# Altium schematic sheet NNLightSwitcher_DDR3.SchDoc
size A4 portrait
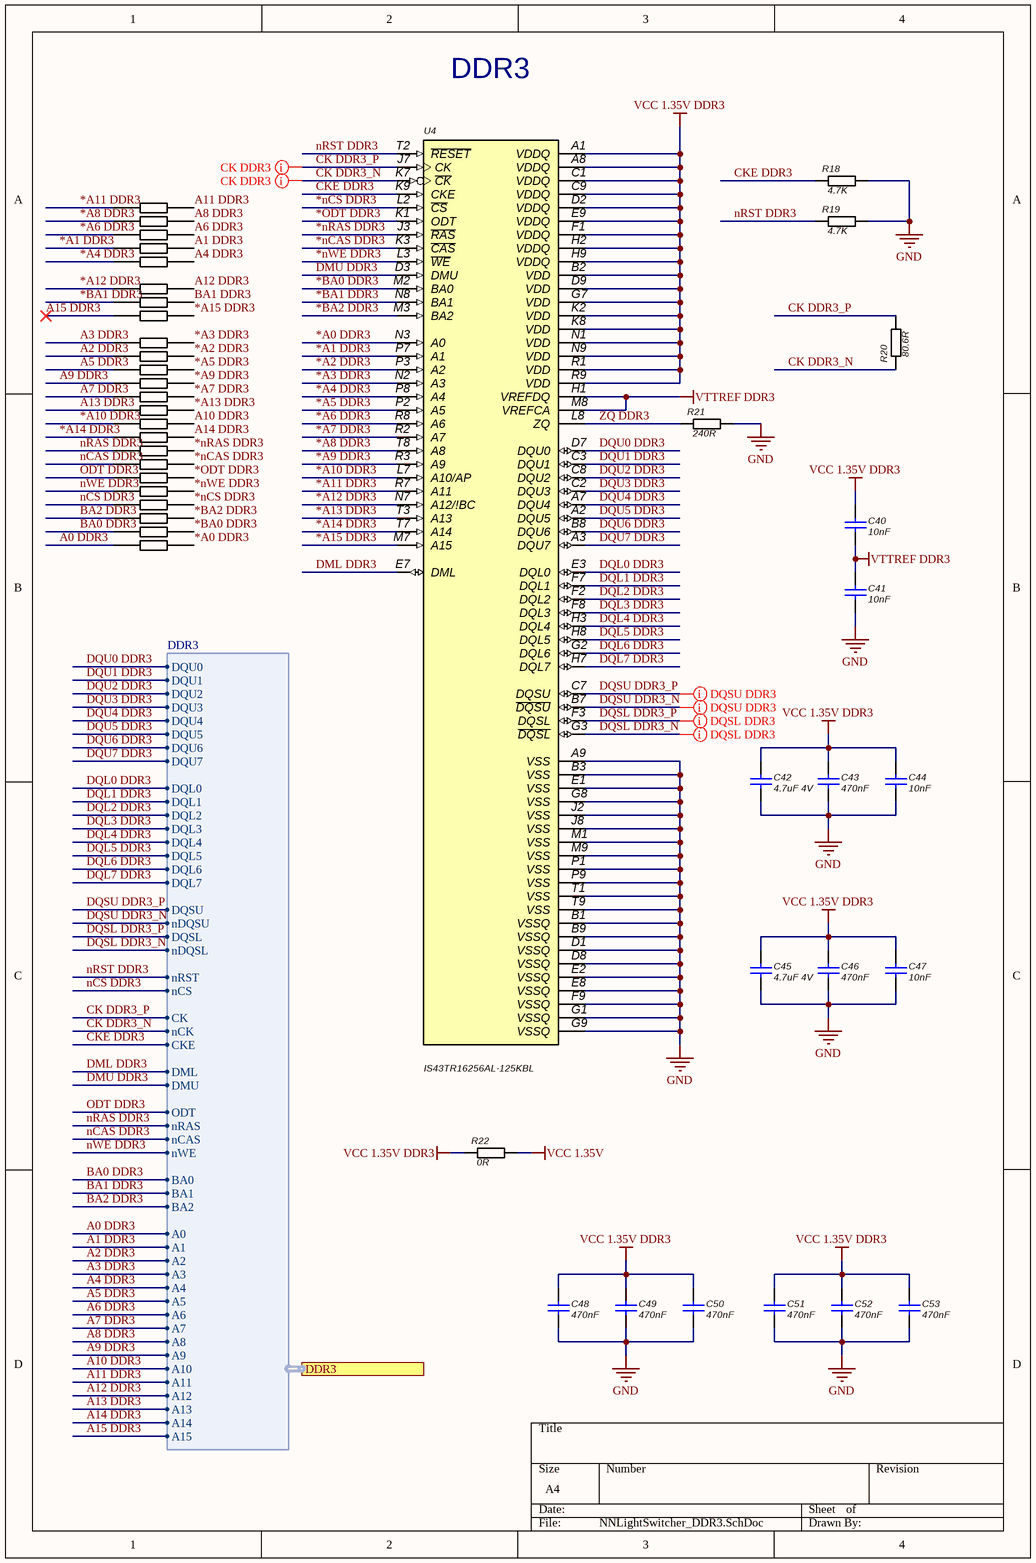
[diagram p0: NNLightSwitcher_DDR3.SchDoc]

## Parts
C40  10nF  [0402]
C41  10nF  [0402]
C42  4.7uF 4V  [0402]
C43  470nF  [0402]
C44  10nF  [0402]
C45  4.7uF 4V  [0402]
C46  470nF  [0402]
C47  10nF  [0402]
C48  470nF  [0402]
C49  470nF  [0402]
C50  470nF  [0402]
C51  470nF  [0402]
C52  470nF  [0402]
C53  470nF  [0402]
R18  4.7K  [0402]
R19  4.7K  [0402]
R20  80.6R  [0402]
R21  240R  [0402]
R22  0R  [0402]
RN1  EXB-2HV431JV  [*RESCAXE50P380X160X55-16N]  (value not drawn)  (parts A,B,C,D,E,F,G,H of 8)
RN2  EXB-2HV431JV  [*RESCAXE50P380X160X55-16N]  (value not drawn)  (parts A,B,C,D,E,F,G,H of 8)
RN3  EXB-2HV431JV  [*RESCAXE50P380X160X55-16N]  (value not drawn)  (parts A,B,C,D,E,F,G,H of 8)
U4  IS43TR16256AL-125KBL  [*BGA96C80P9X16_900X1300X120_IS43TR16256AL-125KBL(Primary)]

## Ports
DDR3 (harness DDR3)

## Harnesses
DDR3: A12, A11, A14, A13, A10, A9, A15, A8, A7, A6, A5, A4, A3, A2, A1, A0, BA2, BA1, BA0, nWE, nCAS, nRAS, ODT, DMU, DML, CKE, nCK, CK, nCS, nRST, nDQSL, nDQSU, DQSL, DQSU, DQL7, DQL6, DQL5, DQL4, DQL3, DQL2, DQL1, DQL0, DQU7, DQU6, DQU5, DQU4, DQU3, DQU2, DQU1, DQU0

## Nets
GND: C41.2 C42.2 C43.2 C44.2 C45.2 C46.2 C47.2 C48.2 C49.2 C50.2 C51.2 C52.2 C53.2 R18.2 R19.2 R21.2 U4.A9(VSS) U4.B1(VSSQ) U4.B3(VSS) U4.B9(VSSQ) U4.D1(VSSQ) U4.D8(VSSQ) U4.E1(VSS) U4.E2(VSSQ) U4.E8(VSSQ) U4.F9(VSSQ) U4.G1(VSSQ) U4.G8(VSS) U4.G9(VSSQ) U4.J2(VSS) U4.J8(VSS) U4.M1(VSS) U4.M9(VSS) U4.P1(VSS) U4.P9(VSS) U4.T1(VSS) U4.T9(VSS)
VCC 1.35V: R22.2
VCC 1.35V DDR3: C40.1 C42.1 C43.1 C44.1 C45.1 C46.1 C47.1 C48.1 C49.1 C50.1 C51.1 C52.1 C53.1 R22.1 U4.A1(VDDQ) U4.A8(VDDQ) U4.B2(VDD) U4.C1(VDDQ) U4.C9(VDDQ) U4.D2(VDDQ) U4.D9(VDD) U4.E9(VDDQ) U4.F1(VDDQ) U4.G7(VDD) U4.H2(VDDQ) U4.H9(VDDQ) U4.K2(VDD) U4.K8(VDD) U4.N1(VDD) U4.N9(VDD) U4.R1(VDD) U4.R9(VDD)
VTTREF DDR3: C40.2 C41.1 U4.H1(VREFDQ) U4.M8(VREFCA)
*A0 DDR3: RN3.9 U4.N3(A0)
*A1 DDR3: RN1.4 U4.P7(A1)
*A2 DDR3: RN2.15 U4.P3(A2)
*A3 DDR3: RN2.16 U4.N2(A3)
*A4 DDR3: RN1.5 U4.P8(A4)
*A5 DDR3: RN2.14 U4.P2(A5)
*A6 DDR3: RN1.3 U4.R8(A6)
*A7 DDR3: RN2.12 U4.R2(A7)
*A8 DDR3: RN1.2 U4.T8(A8)
*A9 DDR3: RN2.13 U4.R3(A9)
*A10 DDR3: RN2.7 U4.L7(A10/AP)
*A11 DDR3: RN1.1 U4.R7(A11)
*A12 DDR3: RN1.6 U4.N7(A12/!BC)
*A13 DDR3: RN2.11 U4.T3(A13)
*A14 DDR3: RN2.8 U4.T7(A14)
*A15 DDR3: RN1.8 U4.M7(A15)
*BA0 DDR3: RN3.10 U4.M2(BA0)
*BA1 DDR3: RN1.7 U4.N8(BA1)
*BA2 DDR3: RN3.11 U4.M3(BA2)
*nCAS DDR3: RN3.15 U4.K3(~{CAS})
*nCS DDR3: RN3.12 U4.L2(~{CS})
*nRAS DDR3: RN3.16 U4.J3(~{RAS})
*nWE DDR3: RN3.13 U4.L3(~{WE})
*ODT DDR3: RN3.14 U4.K1(ODT)
A0 DDR3: RN3.8 ; port DDR3.A0
A1 DDR3: RN1.13 ; port DDR3.A1
A2 DDR3: RN2.2 ; port DDR3.A2
A3 DDR3: RN2.1 ; port DDR3.A3
A4 DDR3: RN1.12 ; port DDR3.A4
A5 DDR3: RN2.3 ; port DDR3.A5
A6 DDR3: RN1.14 ; port DDR3.A6
A7 DDR3: RN2.5 ; port DDR3.A7
A8 DDR3: RN1.15 ; port DDR3.A8
A9 DDR3: RN2.4 ; port DDR3.A9
A10 DDR3: RN2.10 ; port DDR3.A10
A11 DDR3: RN1.16 ; port DDR3.A11
A12 DDR3: RN1.11 ; port DDR3.A12
A13 DDR3: RN2.6 ; port DDR3.A13
A14 DDR3: RN2.9 ; port DDR3.A14
A15 DDR3: RN1.9 ; port DDR3.A15
BA0 DDR3: RN3.7 ; port DDR3.BA0
BA1 DDR3: RN1.10 ; port DDR3.BA1
BA2 DDR3: RN3.6 ; port DDR3.BA2
CK DDR3_N: R20.1 U4.K7(~{CK}) ; port DDR3.nCK
CK DDR3_P: R20.2 U4.J7(CK) ; port DDR3.CK
CKE DDR3: R18.1 U4.K9(CKE) ; port DDR3.CKE
DML DDR3: U4.E7(DML) ; port DDR3.DML
DMU DDR3: U4.D3(DMU) ; port DDR3.DMU
DQL0 DDR3: U4.E3(DQL0) ; port DDR3.DQL0
DQL1 DDR3: U4.F7(DQL1) ; port DDR3.DQL1
DQL2 DDR3: U4.F2(DQL2) ; port DDR3.DQL2
DQL3 DDR3: U4.F8(DQL3) ; port DDR3.DQL3
DQL4 DDR3: U4.H3(DQL4) ; port DDR3.DQL4
DQL5 DDR3: U4.H8(DQL5) ; port DDR3.DQL5
DQL6 DDR3: U4.G2(DQL6) ; port DDR3.DQL6
DQL7 DDR3: U4.H7(DQL7) ; port DDR3.DQL7
DQSL DDR3_N: U4.G3(~{DQSL}) ; port DDR3.nDQSL
DQSL DDR3_P: U4.F3(DQSL) ; port DDR3.DQSL
DQSU DDR3_N: U4.B7(~{DQSU}) ; port DDR3.nDQSU
DQSU DDR3_P: U4.C7(DQSU) ; port DDR3.DQSU
DQU0 DDR3: U4.D7(DQU0) ; port DDR3.DQU0
DQU1 DDR3: U4.C3(DQU1) ; port DDR3.DQU1
DQU2 DDR3: U4.C8(DQU2) ; port DDR3.DQU2
DQU3 DDR3: U4.C2(DQU3) ; port DDR3.DQU3
DQU4 DDR3: U4.A7(DQU4) ; port DDR3.DQU4
DQU5 DDR3: U4.A2(DQU5) ; port DDR3.DQU5
DQU6 DDR3: U4.B8(DQU6) ; port DDR3.DQU6
DQU7 DDR3: U4.A3(DQU7) ; port DDR3.DQU7
nCAS DDR3: RN3.2 ; port DDR3.nCAS
nCS DDR3: RN3.5 ; port DDR3.nCS
nRAS DDR3: RN3.1 ; port DDR3.nRAS
nRST DDR3: R19.1 U4.T2(~{RESET}) ; port DDR3.nRST
nWE DDR3: RN3.4 ; port DDR3.nWE
ODT DDR3: RN3.3 ; port DDR3.ODT
ZQ DDR3: R21.1 U4.L8(ZQ)

## Layout directives
differential pair: CK DDR3_N, CK DDR3_P, DQSL DDR3_N, DQSL DDR3_P, DQSU DDR3_N, DQSU DDR3_P

## Notes on the sheet
- DDR3

## Library data of the parts
C40 C41 C44 C47 = Capacitor 10nF: ComponentLink1Description: Datasheet link; ComponentLink1URL: http://www.yageo.com/documents/recent/UPY-GP_NP0_16V-to-50V_16.pdf
C42 C45 = Capacitor 4.7uF 4V: ComponentLink1Description: Datasheet link; ComponentLink1URL: http://www.yageo.com/documents/recent/UPY-GP_NP0_16V-to-50V_16.pdf
C43 C46 C48-C53 = Capacitor 470nF: ComponentLink1Description: Datasheet link; ComponentLink1URL: http://www.yageo.com/documents/recent/UPY-GP_NP0_16V-to-50V_16.pdf
R18 R19 = Resistor 4.7K
R20 = Resistor 80.6R
R21 = Resistor 240R
R22 = Resistor 0R
RN1-RN3 = EXB-2HV431JV: Res Thick Film Array; Value: 33 R
U4 = IS43TR16256AL-125KBL: 4G, 1.35V, DDR3L, 256Mx16, 1600MT/s @ 11-11-11, 96 ball BGA _9mm x13mm_ RoHS; Manufacturer 1: ISSI; Access Time: 255ps; Data Bus Width: 16b; Frequency: 800MHz; Interface: Parallel; Max Supply Voltage: 1.45V; Memory Size: 4Gb; Memory Type: RAM,DDR3 SDRAM; Min Supply Voltage: 1.283V; Value: *; Case/Package: TFBGA; ComponentLink1Description: https://datasheet.ciiva.com/18617/43-46tr16256a-85120al-18617927.pdf?src-supplier=Digi-Key; ComponentLink1URL: https://datasheet.ciiva.com/18617/43-46tr16256a-85120al-18617927.pdf?src-supplier=Digi-Key; Manufacturer 2: ISSI; Manufacturer Part Number 1: IS43TR16256AL-125KBL; Manufacturer Part Number 2: IS43TR16256AL-125KBL; Max Frequency: 800MHz; Max Operating Temperature: 70°C; Min Operating Temperature: 0°C; Number of Pins: 96; Package Quantity: 190; Packaging: Tray; Pricing 1: 1=8,90000, 10=8,18800, 25=8,01840, 50=7,99000, 190=7,16784, 380=6,95047, 570=6,61028, 1140=6,37875 (USD); Pricing 2: 1=8,90000, 10=8,19000, 25=8,00000, 50=8,00000, 100=7,17000, 250=6,96000, 500=6,61000, 1000=6,61000, 10000=6,61000 (USD); RoHS: Yes; Stock 1: 6597; Stock 2: 3561; Supplier 1: Digi-Key; Supplier 2: Mouser; Supplier Part Number 1: 706-1207-ND; Supplier Part Number 2: 870-43T16256AL125KBL